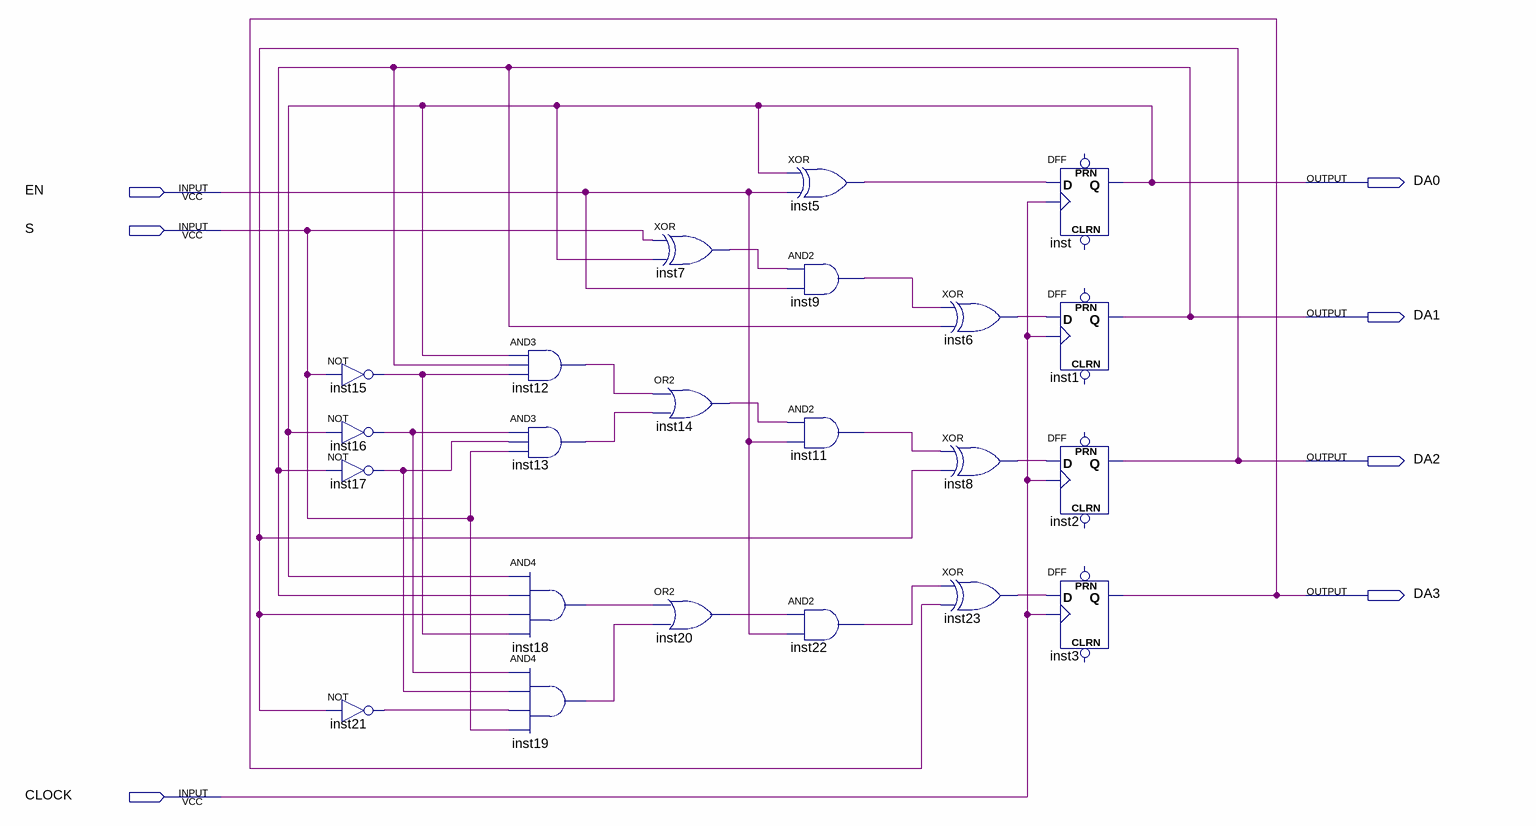
[diagram p0: schematic sheet]
// Quartus schematic Up-Down_Binary_Counter.bdf as structural Verilog: 22 symbols, 7 pins
module \Up-Down_Binary_Counter  (
  input  EN,
  input  S,
  input  CLOCK,
  output DA0,
  output DA1,
  output DA2,
  output DA3
);

  wire inst5_out, inst6_out, inst7_out, inst8_out, inst9_out, inst11_out, inst12_out, inst13_out, inst14_out,
       inst15_out, inst16_out, inst17_out, inst18_out, inst19_out, inst20_out, inst21_out, inst22_out,
       inst23_out;

  not inst15 (inst15_out, S);
  not inst16 (inst16_out, DA0);
  not inst17 (inst17_out, DA1);
  not inst21 (inst21_out, DA2);
  and inst12 (inst12_out, DA0, DA1, inst15_out);
  and inst13 (inst13_out, inst16_out, inst17_out, S);
  and inst18 (inst18_out, DA0, DA1, DA2, inst15_out);
  and inst19 (inst19_out, inst16_out, inst17_out, inst21_out, S);
  xor inst7 (inst7_out, S, DA0);
  or inst14 (inst14_out, inst12_out, inst13_out);
  or inst20 (inst20_out, inst18_out, inst19_out);
  xor inst5 (inst5_out, DA0, EN);
  and inst9 (inst9_out, inst7_out, EN);
  and inst11 (inst11_out, inst14_out, EN);
  and inst22 (inst22_out, inst20_out, EN);
  xor inst6 (inst6_out, inst9_out, DA1);
  xor inst8 (inst8_out, inst11_out, DA2);
  xor inst23 (inst23_out, inst22_out, DA3);
  DFF inst (.CLK(CLOCK), .D(inst5_out), .Q(DA0));  // open: CLRN, PRN
  DFF inst1 (.CLK(CLOCK), .D(inst6_out), .Q(DA1));  // open: CLRN, PRN
  DFF inst2 (.CLK(CLOCK), .D(inst8_out), .Q(DA2));  // open: CLRN, PRN
  DFF inst3 (.CLK(CLOCK), .D(inst23_out), .Q(DA3));  // open: CLRN, PRN
endmodule
